# EAGLE design breakout-r2 (EAGLE 8.3.1)
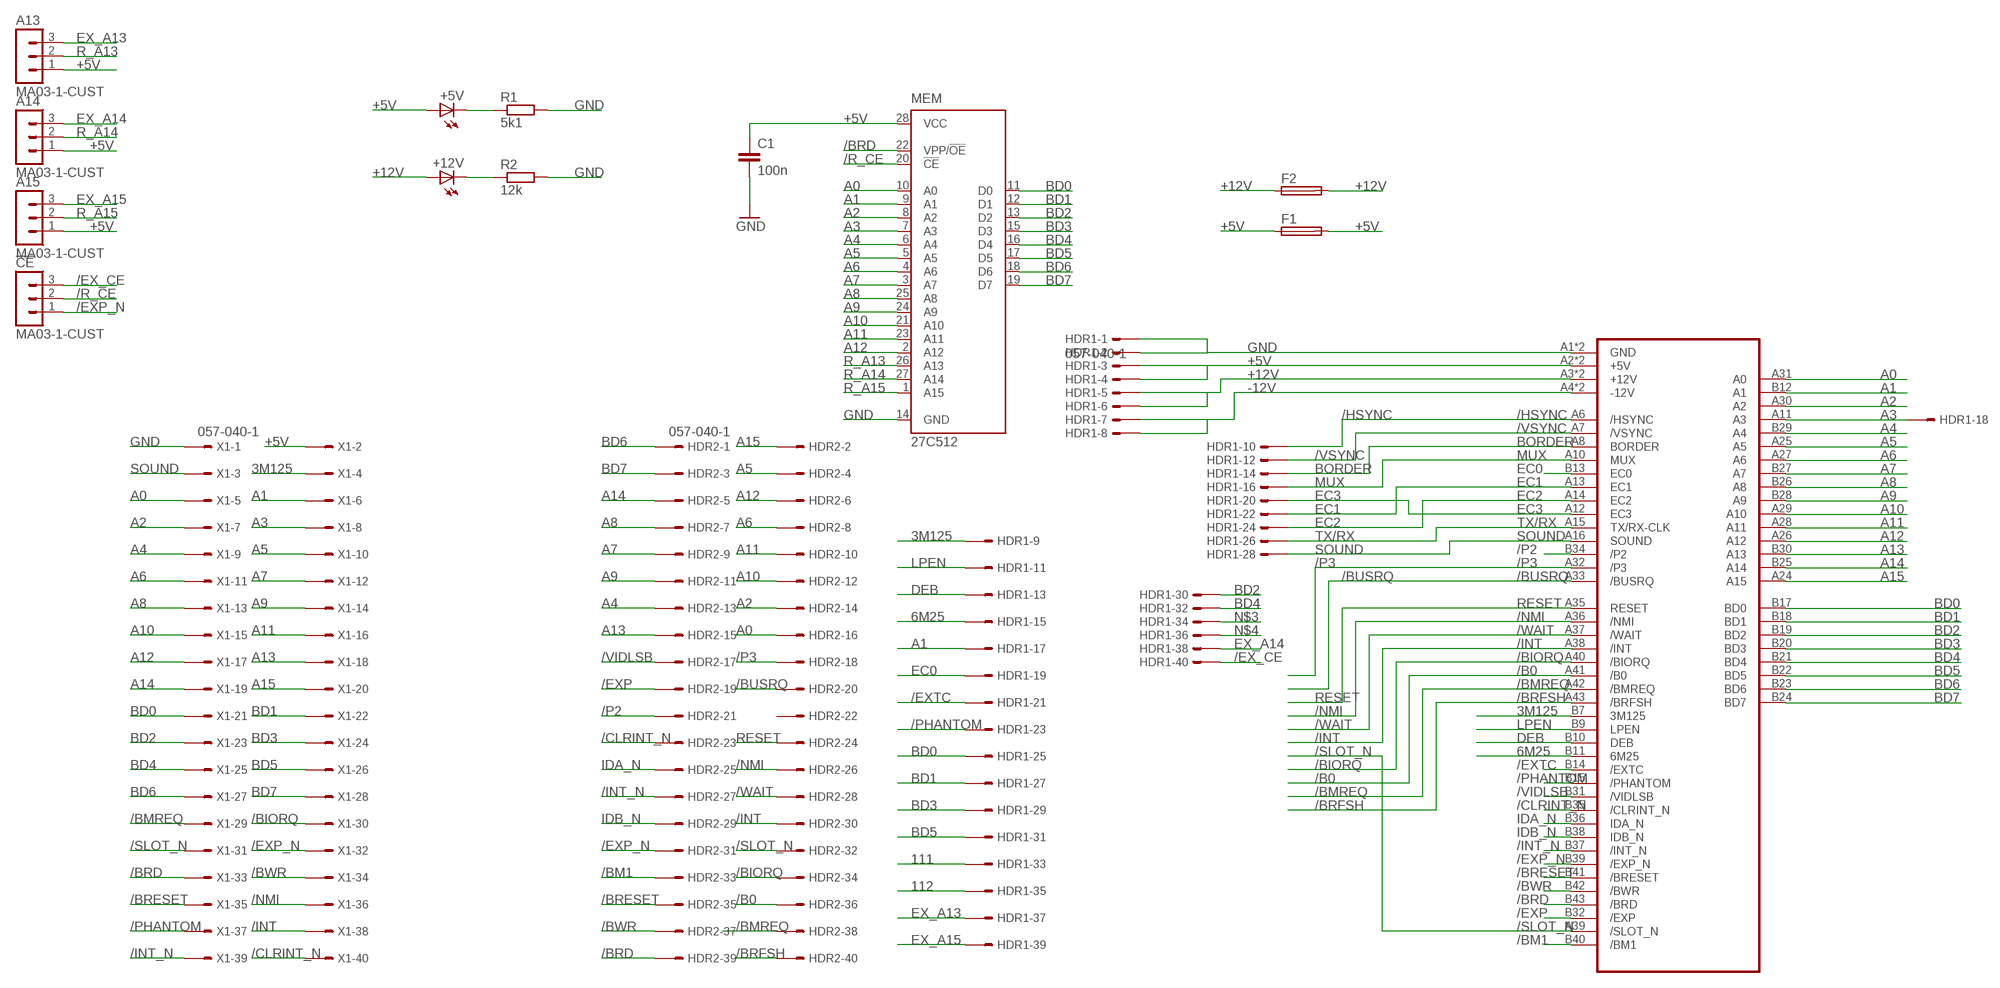
[diagram p0: schematic, sheet 1]

## Parts
!CE  MA03-1-CUST  [MA03-1]
+5V  LED3MM  [LED3MM]
+12V  LED3MM  [LED3MM]
A13  MA03-1-CUST  [MA03-1]
A14  MA03-1-CUST  [MA03-1]
A15  MA03-1-CUST  [MA03-1]
C1  100n  C-EU025-025X050  [C025-025X050]
F1  TE5  [TE5]
F2  TE5  [TE5]
HDR1  057-040-1  [057-040-1]
HDR2  057-040-1  [057-040-1]
MEM  27C512  W27C512  [DIL28-6]
R1  5k1  R-EU_0204/7  [0204/7]
R2  12k  R-EU_0204/7  [0204/7]
U$1  TVC-EXP-HBA-COMMON  [TVC-EXP-EDGE]
X1  057-040-1  [057-040-1]

## Nets
3M125: HDR1.9 U$1.B7(3M125) X1.4
6M25: HDR1.15 U$1.B11(6M25)
111: HDR1.33
112: HDR1.35
+5V [pwr]: +5V.A A13.1 A14.1 A15.1 C1.1 F1.1 F1.2 HDR1.3 HDR1.4 MEM.28(VCC) U$1.A2(+5V) U$1.B2(+5V) X1.2
+12V [pwr]: +12V.A F2.1 F2.2 HDR1.5 HDR1.6 U$1.A3(+12V) U$1.B3(+12V)
-12V [pwr]: HDR1.7 HDR1.8 U$1.A4(-12V) U$1.B4(-12V)
/B0: HDR2.36 U$1.A41(/B0)
/BIORQ: HDR2.34 U$1.A40(/BIORQ) X1.30
/BM1: HDR2.33 U$1.B40(/BM1)
/BMREQ: HDR2.38 U$1.A42(/BMREQ) X1.29
/BRD: HDR2.39 MEM.22(VPP/!OE) U$1.B43(/BRD) X1.33
/BRESET: HDR2.35 U$1.B41(/BRESET) X1.35
/BRFSH: HDR2.40 U$1.A43(/BRFSH)
/BUSRQ: HDR2.20 U$1.A33(/BUSRQ)
/BWR: HDR2.37 U$1.B42(/BWR) X1.34
/CLRINT_N: HDR2.23 U$1.B35(/CLRINT_N) X1.40
/EX_CE: !CE.3 HDR1.40
/EXP: HDR2.19 U$1.B32(/EXP)
/EXP_N: !CE.1 HDR2.31 U$1.B39(/EXP_N) X1.32
/EXTC: HDR1.21 U$1.B14(/EXTC)
/HSYNC: HDR1.10 U$1.A6(/HSYNC)
/INT: HDR2.30 U$1.A38(/INT) X1.38
/INT_N: HDR2.27 U$1.B37(/INT_N) X1.39
/NMI: HDR2.26 U$1.A36(/NMI) X1.36
/P2: HDR2.21 U$1.B34(/P2)
/P3: HDR2.18 U$1.A32(/P3)
/PHANTOM: HDR1.23 U$1.B15(/PHANTOM) X1.37
/R_CE: !CE.2 MEM.20(!CE)
/SLOT_N: HDR2.32 U$1.A39(/SLOT_N) X1.31
/VIDLSB: HDR2.17 U$1.B31(/VIDLSB)
/VSYNC: HDR1.12 U$1.A7(/VSYNC)
/WAIT: HDR2.28 U$1.A37(/WAIT)
A0: HDR2.16 MEM.10(A0) U$1.A31(A0) X1.5
A1: HDR1.17 MEM.9(A1) U$1.B12(A1) X1.6
A2: HDR2.14 MEM.8(A2) U$1.A30(A2) X1.7
A3: HDR1.18 MEM.7(A3) U$1.A11(A3) X1.8
A4: HDR2.13 MEM.6(A4) U$1.B29(A4) X1.9
A5: HDR2.4 MEM.5(A5) U$1.A25(A5) X1.10
A6: HDR2.8 MEM.4(A6) U$1.A27(A6) X1.11
A7: HDR2.9 MEM.3(A7) U$1.B27(A7) X1.12
A8: HDR2.7 MEM.25(A8) U$1.B26(A8) X1.13
A9: HDR2.11 MEM.24(A9) U$1.B28(A9) X1.14
A10: HDR2.12 MEM.21(A10) U$1.A29(A10) X1.15
A11: HDR2.10 MEM.23(A11) U$1.A28(A11) X1.16
A12: HDR2.6 MEM.2(A12) U$1.A26(A12) X1.17
A13: HDR2.15 U$1.B30(A13) X1.18
A14: HDR2.5 U$1.B25(A14) X1.19
A15: HDR2.2 U$1.A24(A15) X1.20
BD0: HDR1.25 MEM.11(D0) U$1.B17(BD0) X1.21
BD1: HDR1.27 MEM.12(D1) U$1.B18(BD1) X1.22
BD2: HDR1.30 MEM.13(D2) U$1.B19(BD2) X1.23
BD3: HDR1.29 MEM.15(D3) U$1.B20(BD3) X1.24
BD4: HDR1.32 MEM.16(D4) U$1.B21(BD4) X1.25
BD5: HDR1.31 MEM.17(D5) U$1.B22(BD5) X1.26
BD6: HDR2.1 MEM.18(D6) U$1.B23(BD6) X1.27
BD7: HDR2.3 MEM.19(D7) U$1.B24(BD7) X1.28
BORDER: HDR1.14 U$1.A8(BORDER)
DEB: HDR1.13 U$1.B10(DEB)
EC0: HDR1.19 U$1.B13(EC0)
EC1: HDR1.22 U$1.A13(EC1)
EC2: HDR1.24 U$1.A14(EC2)
EC3: HDR1.20 U$1.A12(EC3)
EX_A13: A13.3 HDR1.37
EX_A14: A14.3 HDR1.38
EX_A15: A15.3 HDR1.39
GND [pwr]: C1.2 HDR1.1 HDR1.2 MEM.14(GND) R1.2 R2.2 U$1.A1(GND) U$1.B1(GND) X1.1
IDA_N: HDR2.25 U$1.B36(IDA_N)
IDB_N: HDR2.29 U$1.B38(IDB_N)
LPEN: HDR1.11 U$1.B9(LPEN)
MUX: HDR1.16 U$1.A10(MUX)
N$1: +5V.K(C) R1.1
N$2: +12V.K(C) R2.1
N$3: HDR1.34
N$4: HDR1.36
R_A13: A13.2 MEM.26(A13)
R_A14: A14.2 MEM.27(A14)
R_A15: A15.2 MEM.1(A15)
RESET: HDR2.24 U$1.A35(RESET)
SOUND: HDR1.28 U$1.A16(SOUND) X1.3
TX/RX: HDR1.26 U$1.A15(TX/RX-CLK)
Unconnected: HDR2.22

## Library data of the parts
!CE A13-A15 = MA03-1-custom:MA03-1-CUST
+5V +12V = led:LED: LED OSRAM: - CHIPLED LG R971, LG N971, LY N971, LG Q971, LY Q971, LO R971, LY R971 LH N974, LH R974 LS Q976, LO Q976, LY Q976 LO Q996 - Hyper CHIPLED LW Q18S LB Q993, LB Q99A, LB R99A - SideLED LS A670, LO A670, LY A670, LG A670, LP A670 LB A673, LV A673, LT A673, LW A673 LH A674 LY A675 LS A676, LA A676, LO A676, LY A676, LW A676 LS A679, LY A679, LG A679 - Hyper Micro SIDELED® LS Y876, LA Y876, LO Y876, LY Y876 LT Y87S - SmartLED LW L88C, LW L88S LB L89C, LB L89S, LG L890 LS L89K, LO L89K, LY L89K LS L896, LA L896, LO L896, LY L896 - TOPLED LS T670, LO T670, LY T670, LG T670, LP T670 LSG T670, LSP T670, LSY T670, LOP T670, LYG T670 LG T671, LOG T671, LSG T671 LB T673, LV T673, LT T673, LW T673 LH T674 LS T676, LA T676, LO T676, LY T676, LB T676, LH T676, LSB T676, LW T676 LB T67C, LV T67C, LT T67C, LS T67K, LO T67K, LY T67K, LW E67C LS E67B, LA E67B, LO E67B, LY E67B, LB E67C, LV E67C, LT E67C LW T67C LS T679, LY T679, LG T679 LS T770, LO T770, LY T770, LG T770, LP T770 LB T773, LV T773, LT T773, LW T773 LH T774 LS E675, LA E675, LY E675, LS T675 LS T776, LA T776, LO T776, LY T776, LB T776 LHGB T686 LT T68C, LB T68C - Hyper Mini TOPLED® LB M676 - Mini TOPLED Santana® LG M470 LS M47K, LO M47K, LY M47K Source: http://www.osram.convergy.de LUXEON: - LUMILED® LXK2-PW12-R00, LXK2-PW12-S00, LXK2-PW14-U00, LXK2-PW14-V00 LXK2-PM12-R00, LXK2-PM12-S00, LXK2-PM14-U00 LXK2-PE12-Q00, LXK2-PE12-R00, LXK2-PE12-S00, LXK2-PE14-T00, LXK2-PE14-U00 LXK2-PB12-K00, LXK2-PB12-L00, LXK2-PB12-M00, LXK2-PB14-N00, LXK2-PB14-P00, LXK2-PB14-Q00 LXK2-PR12-L00, LXK2-PR12-M00, LXK2-PR14-Q00, LXK2-PR14-R00 LXK2-PD12-Q00, LXK2-PD12-R00, LXK2-PD12-S00 LXK2-PH12-R00, LXK2-PH12-S00 LXK2-PL12-P00, LXK2-PL12-Q00, LXK2-PL12-R00 Source: www.luxeon.com KINGBRIGHT: KA-3528ASYC Source: www.kingbright.com
C1 = rcl:C-EU: CAPACITOR, European symbol
F1 F2 = fuse:TE5: FUSE Wickmann; OC_FARNELL: unknown; OC_NEWARK: unknown
HDR1 HDR2 X1 = con-panduit:057-040-: CONNECTOR 40-pin series 057 contact pc board low profile headers; OC_FARNELL: unknown; OC_NEWARK: unknown
MEM = Winbond:W27C512
R1 R2 = resistor:R-EU_: RESISTOR, European symbol
U$1 = tvc-exp:TVC-EXP-HBA-COMMON: Videoton TV-Computer expansion port edge connector, common pins for 32k, 64k and 64k+

## Net classes
0 default: width 0.254 mm
1 pwr: width 0.508 mm, clearance 0.254 mm

## Board
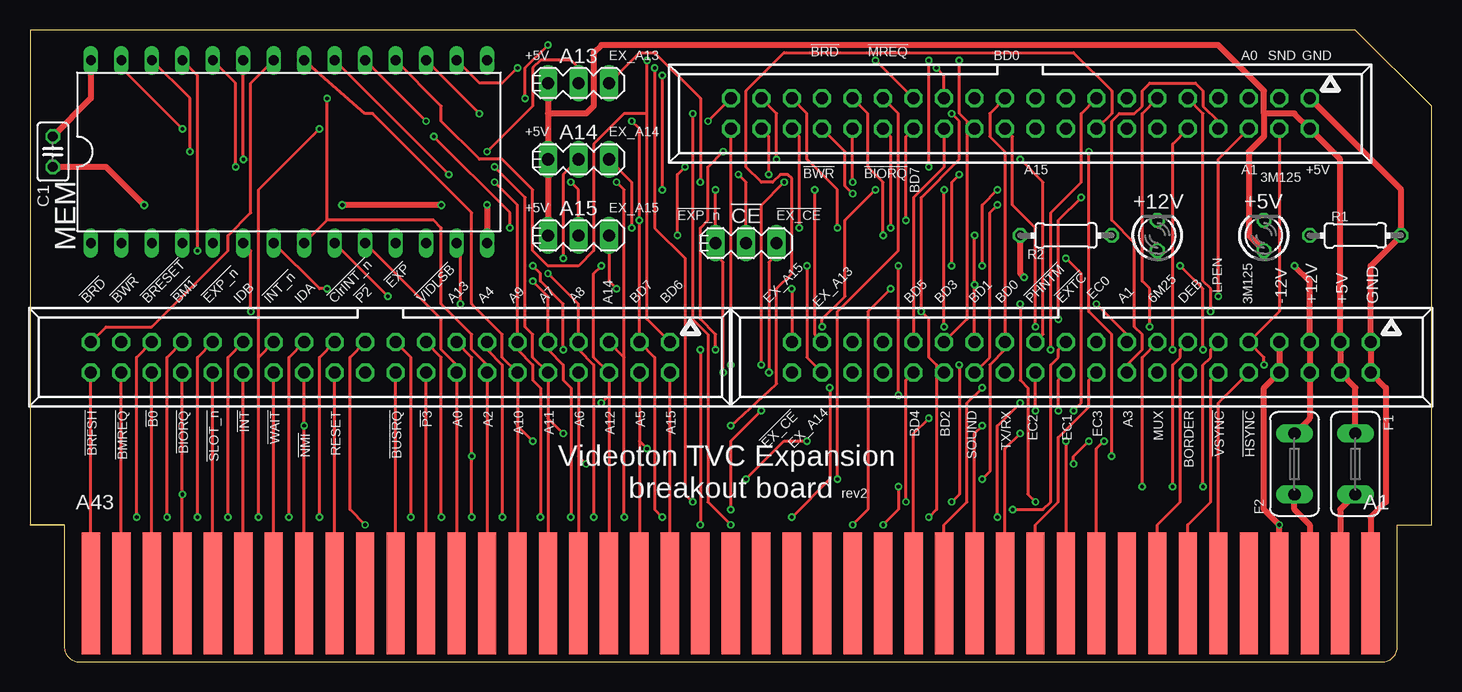
[diagram p1: board, top side]
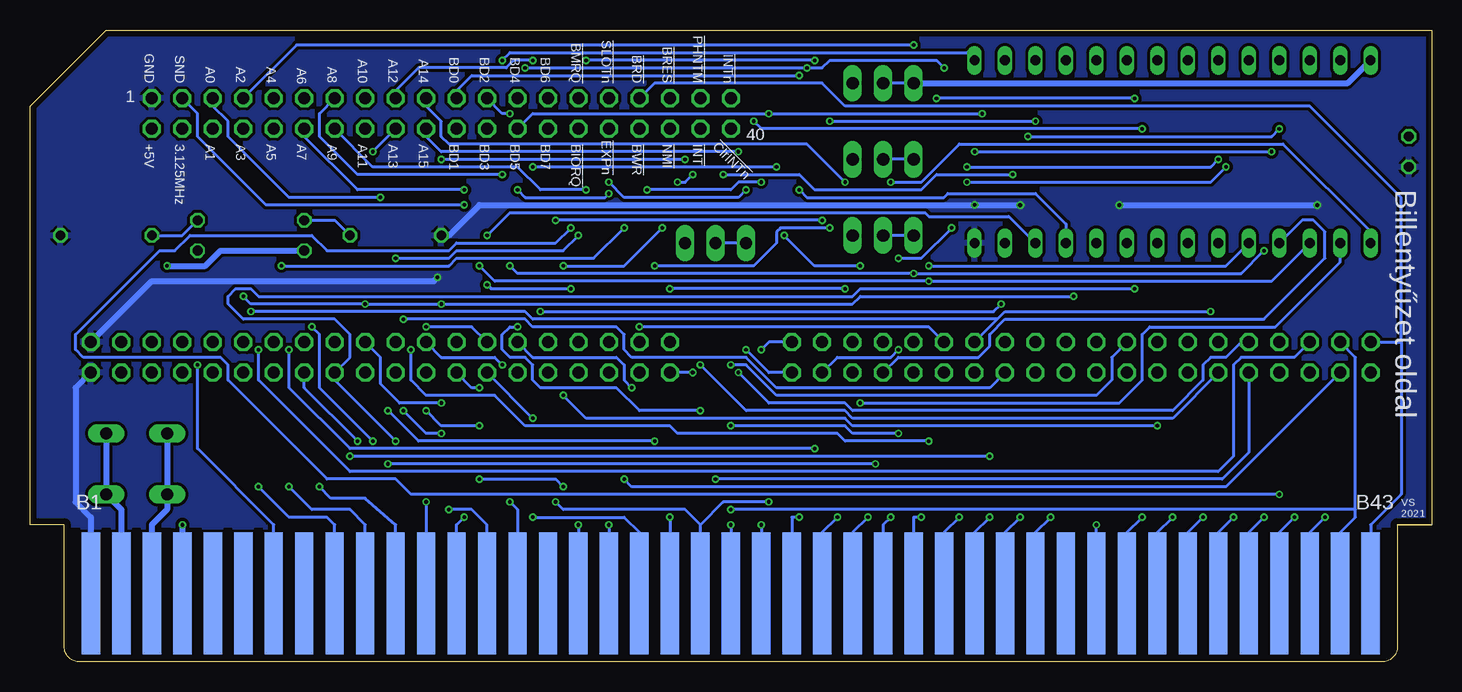
[diagram p2: board, bottom side, seen from below]

Size 116.84 x 52.7 mm. Coordinates in mm from the lower left corner, seen from the top.
Outline: 113.98,11.43 116.84,11.43 116.84,46.35 110.49,52.7 0,52.7 0,11.43 2.86,11.43
Copper layers (1*16): Top 0.035mm / dielectric 1.6mm / Bottom 0.035mm
Design rules "Elecrow_2-layer_PCB_eagle_rule": minimum track width 6mil, minimum drill 12mil, track to track 6mil, track to pad 6mil, pad to pad 6mil, via to via 8mil, smd to smd 0mil, copper to edge 20mil, drill to drill 10mil, minimum pad ring 6mil, minimum via ring 6mil, stop-mask expansion 0mil, vias tented up to drill 100mil, thermal gap 10mil
bRestrict: area 44.1,47 to 44.8,49.5; area 44.1,40.6 to 44.8,43.2; area 44.1,34.3 to 44.8,36.8; area 58.1,33.7 to 58.7,36.2

### Footprints (pad centres in the part's own frame; a part is rotated, then mirrored left to right if it is on the bottom)
MA03-1 = drill 1.016 long: 1 -2.54,0; 2 0,0; 3 2.54,0
LED3MM = drill 0.813 octagon: A -1.27,0; K 1.27,0
C025-025X050 = drill 0.813 octagon: 1 -1.27,0; 2 1.27,0
TE5 = drill 1.016 long: 1 -2.54,0; 2 2.54,0
057-040-1 = drill 1 octagon: 1 -24.13,-1.27; 2 -24.13,1.27; 3 -21.59,-1.27; 4 -21.59,1.27; 5 -19.05,-1.27; 6 -19.05,1.27; 7 -16.51,-1.27; 8 -16.51,1.27; 9 -13.97,-1.27; 10 -13.97,1.27; 11 -11.43,-1.27; 12 -11.43,1.27; 13 -8.89,-1.27; 14 -8.89,1.27; 15 -6.35,-1.27; 16 -6.35,1.27; 17 -3.81,-1.27; 18 -3.81,1.27; 19 -1.27,-1.27; 20 -1.27,1.27; 21 1.27,-1.27; 22 1.27,1.27; 23 3.81,-1.27; 24 3.81,1.27; 25 6.35,-1.27; 26 6.35,1.27; 27 8.89,-1.27; 28 8.89,1.27; 29 11.43,-1.27; 30 11.43,1.27; 31 13.97,-1.27; 32 13.97,1.27; 33 16.51,-1.27; 34 16.51,1.27; 35 19.05,-1.27; 36 19.05,1.27; 37 21.59,-1.27; 38 21.59,1.27; 39 24.13,-1.27; 40 24.13,1.27
DIL28-6 = drill 0.813 long: 1 -16.51,-7.62; 2 -13.97,-7.62; 3 -11.43,-7.62; 4 -8.89,-7.62; 5 -6.35,-7.62; 6 -3.81,-7.62; 7 -1.27,-7.62; 8 1.27,-7.62; 9 3.81,-7.62; 10 6.35,-7.62; 11 8.89,-7.62; 12 11.43,-7.62; 13 13.97,-7.62; 14 16.51,-7.62; 15 16.51,7.62; 16 13.97,7.62; 17 11.43,7.62; 18 8.89,7.62; 19 6.35,7.62; 20 3.81,7.62; 21 1.27,7.62; 22 -1.27,7.62; 23 -3.81,7.62; 24 -6.35,7.62; 25 -8.89,7.62; 26 -11.43,7.62; 27 -13.97,7.62; 28 -16.51,7.62
0204/7 = drill 0.813 octagon: 1 -3.81,0; 2 3.81,0
TVC-EXP-EDGE = smd 1.524 x 10.16: A1 53.34,-5.715; A2 50.8,-5.715; A3 48.26,-5.715; A4 45.72,-5.715; A5 43.18,-5.715; A6 40.64,-5.715; A7 38.1,-5.715; A8 35.56,-5.715; A9 33.02,-5.715; A10 30.48,-5.715; A11 27.94,-5.715; A12 25.4,-5.715; A13 22.86,-5.715; A14 20.32,-5.715; A15 17.78,-5.715; A16 15.24,-5.715; A17 12.7,-5.715; A18 10.16,-5.715; A19 7.62,-5.715; A20 5.08,-5.715; A21 2.54,-5.715; A22 0,-5.715; A23 -2.54,-5.715; A24 -5.08,-5.715; A25 -7.62,-5.715; A26 -10.16,-5.715; A27 -12.7,-5.715; A28 -15.24,-5.715; A29 -17.78,-5.715; A30 -20.32,-5.715; A31 -22.86,-5.715; A32 -25.4,-5.715; A33 -27.94,-5.715; A34 -30.48,-5.715; A35 -33.02,-5.715; A36 -35.56,-5.715; A37 -38.1,-5.715; A38 -40.64,-5.715; A39 -43.18,-5.715; A40 -45.72,-5.715; A41 -48.26,-5.715; A42 -50.8,-5.715; A43 -53.34,-5.715 | smd 1.524 x 10.16 bottom: B1 53.34,-5.715; B2 50.8,-5.715; B3 48.26,-5.715; B4 45.72,-5.715; B5 43.18,-5.715; B6 40.64,-5.715; B7 38.1,-5.715; B8 35.56,-5.715; B9 33.02,-5.715; B10 30.48,-5.715; B11 27.94,-5.715; B12 25.4,-5.715; B13 22.86,-5.715; B14 20.32,-5.715; B15 17.78,-5.715; B16 15.24,-5.715; B17 12.7,-5.715; B18 10.16,-5.715; B19 7.62,-5.715; B20 5.08,-5.715; B21 2.54,-5.715; B22 0,-5.715; B23 -2.54,-5.715; B24 -5.08,-5.715; B25 -7.62,-5.715; B26 -10.16,-5.715; B27 -12.7,-5.715; B28 -15.24,-5.715; B29 -17.78,-5.715; B30 -20.32,-5.715; B31 -22.86,-5.715; B32 -25.4,-5.715; B33 -27.94,-5.715; B34 -30.48,-5.715; B35 -33.02,-5.715; B36 -35.56,-5.715; B37 -38.1,-5.715; B38 -40.64,-5.715; B39 -43.18,-5.715; B40 -45.72,-5.715; B41 -48.26,-5.715; B42 -50.8,-5.715; B43 -53.34,-5.715

### Placement (x,y rotation side)
!CE  59.69,34.92 0 top
+5V  102.87,35.56 90 top
+12V  93.98,35.56 90 top
A13  45.72,48.26 0 top
A14  45.72,41.91 0 top
A15  45.72,35.56 0 top
C1  1.9,42.55 270 top
F1  110.49,16.51 90 top
F2  105.41,16.51 90 top
HDR1  87.63,25.4 180 top
HDR2  29.21,25.4 180 top
MEM  21.59,42.55 0 top
R1  110.49,35.56 0 top
R2  86.36,35.56 180 top
U$1  58.42,11.43 0 top
X1  82.55,45.72 180 top

### Tracks (layer width: path | path; a pad name or v marks a point on that pad's centre or on a via)
3M125  (via drill 0.3)
  Top 0.254: X1.4 104.14,29.21 HDR1.9 102.87,25.4 v102.87,24.77
  Bottom 0.254: v102.87,24.77 102.87,17.78 96.52,11.43 U$1.B7
6M25  (via drill 0.3)
  Top 0.254: HDR1.15 92.71,25.4 v92.71,14.61
  Bottom 0.254: v92.71,14.61 91.76,13.65 88.9,13.65 86.36,11.43 U$1.B11
+5V
  Top 0.508: A15.1 A14.1 43.18,45.72 | A13.1 43.18,45.72 | +5V.A 101.6,35.56 101.6,42.55 102.87,43.81 102.87,45.72 | 102.87,45.72 105.41,45.72 X1.2 109.22,41.91 HDR1.3 HDR1.4 110.49,22.86 F1.2 | U$1.B2 109.22,12.7 F1.1 | 43.18,45.72 46.35,45.72 46.99,46.35 46.99,50.8 47.62,51.44 99.06,51.44 102.87,47.62 102.87,45.72 | MEM.28 5.08,46.99 C1.1
  Bottom 0.508: MEM.28 6.99,48.26 A13.1 | F1.2 F1.1 109.22,12.7 U$1.B2
+12V  (via drill 0.3)
  Top 0.508: v105.41,33.02 106.68,31.75 HDR1.5 HDR1.6 106.68,20.32 F2.2 | U$1.B3 106.68,11.43 105.41,12.7 F2.1
  Bottom 0.508: F2.2 F2.1 105.41,12.7 106.68,11.43 U$1.B3 | +12V.A 100.97,34.29 102.23,33.02 v105.41,33.02
-12V  (via drill 0.3)
  Top 0.508: HDR1.7 HDR1.8 102.87,22.86 102.87,12.7 v104.14,11.43 U$1.B4
  Bottom 0.508: v104.14,11.43 U$1.B4
/B0
  Top 0.254: U$1.A41 HDR2.36
/BIORQ  (via drill 0.3)
  Top 0.254: U$1.A40 v12.7,13.97 HDR2.34 | X1.30 71.76,43.81 v71.76,36.2
  Bottom 0.254: v71.76,36.2 73.03,34.92 81.28,34.92 81.92,34.29 92.08,34.29 93.34,35.56 103.51,35.56 104.78,34.29 106.05,34.29 113.03,27.3 113.03,26.04 112.4,25.4 100.97,25.4 100.33,24.77 100.33,23.5 92.08,15.24 86.36,15.24 85.09,13.97 v12.7,13.97
/BM1  (via drill 0.3)
  Top 0.254: HDR2.33 11.43,25.4 v11.43,12.06
  Bottom 0.254: U$1.B40 12.7,10.79 v11.43,12.06
/BMREQ  (via drill 0.3)
  Top 0.254: U$1.A42 HDR2.38 | X1.29 72.39,45.72 72.39,34.29 67.31,29.21 v67.31,15.24
  Bottom 0.254: v67.31,15.24 66.67,14.61 17.14,14.61 HDR2.38
/BRD
  Top 0.254: MEM.22 18.41,48.26 18.41,37.47 16.51,35.56 16.51,34.29 10.16,27.94 6.35,27.94 HDR2.39
  Bottom 0.254: X1.33 64.77,48.26 50.8,48.26 48.89,46.35 10.16,46.35 2.54,38.73 2.54,26.67 | HDR2.39 2.54,26.67 | U$1.B43 5.08,11.43 2.54,13.97 2.54,26.67
/BRESET  (via drill 0.3)
  Top 0.254: HDR2.35 8.89,25.4 v8.89,12.06 | X1.35 64.77,45.72 64.77,41.91 67.31,39.37 v67.31,36.2 | v95.89,33.02 97.79,31.11 v97.79,26.04
  Bottom 0.254: U$1.B41 10.16,10.79 v8.89,12.06 | v67.31,36.2 69.85,33.66 81.28,33.66 81.92,33.02 v95.89,33.02 | v97.79,26.04 97.79,23.5 90.17,15.88 17.78,15.88 16.51,17.14 16.51,24.77 15.88,25.4 11.43,25.4 HDR2.35
/BRFSH
  Top 0.254: U$1.A43 HDR2.40
/BUSRQ
  Top 0.254: U$1.A33 HDR2.20
/BWR  (via drill 0.3)
  Top 0.254: X1.34 67.95,42.55 67.95,39.69 v68.58,39.05 | v76.2,27.94 v76.2,39.37 | v60.96,20.95 58.42,18.41 v58.42,12.7
  Bottom 0.254: HDR2.37 6.35,25.4 6.35,12.7 | 6.35,12.7 6.35,12.06 7.62,10.79 U$1.B42 | v68.58,39.05 68.9,38.73 75.56,38.73 v76.2,39.37 | v76.2,27.94 76.84,27.94 77.47,27.3 77.47,26.04 76.84,25.4 75.56,25.4 74.93,24.77 74.93,23.5 74.3,22.86 67.95,22.86 66.04,20.95 v60.96,20.95 | 6.35,12.7 v58.42,12.7
/CLRINT_N  (via drill 0.3)
  Top 0.254: HDR2.23 24.13,25.4 v24.13,12.06 | v58.42,24.77 X1.40
  Bottom 0.254: U$1.B35 25.4,10.79 v24.13,12.06 | v58.42,24.77 57.15,24.77 54.61,22.23 27.94,22.23 26.67,23.5 26.67,25.4 HDR2.23
/EX_CE  (via drill 0.35)
  Top 0.254: v61.59,24.13 61.59,33.34 62.23,33.97 !CE.3
  Bottom 0.254: v61.59,24.13 HDR1.40
/EXP  (via drill 0.3)
  Top 0.254: HDR2.19 31.75,25.4 v31.75,12.06
  Bottom 0.254: U$1.B32 33.02,10.79 v31.75,12.06
/EXP_N  (via drill 0.3)
  Top 0.254: v68.58,40.01 X1.32 | v57.15,39.37 !CE.1 57.15,33.97 57.78,33.34 v57.78,24.13 | HDR2.31 13.97,25.4 v13.97,12.06
  Bottom 0.254: v68.58,40.01 67.31,38.73 57.78,38.73 v57.15,39.37 | U$1.B39 15.24,10.79 v13.97,12.06 | v57.78,24.13 55.24,21.59 48.89,21.59 48.26,20.95 21.59,20.95 19.05,23.5 19.05,24.77 18.41,25.4 17.14,25.4 15.88,26.67 HDR2.31
/EXTC  (via drill 0.3)
  Top 0.254: HDR1.21 85.73,26.04 85.73,25.4 85.09,24.77 85.09,13.34 84.45,12.7 v81.92,12.7
  Bottom 0.254: U$1.B14 78.74,11.43 80.01,12.7 v81.92,12.7
/HSYNC
  Top 0.254: HDR1.10 99.06,21.59 U$1.A6
/INT  (via drill 0.3)
  Top 0.254: U$1.A38 HDR2.30 | X1.38 61.59,43.81 v61.59,40.64 | v62.87,40.01 60.96,38.1 v60.96,24.77
  Bottom 0.254: v61.59,40.64 62.23,40.01 v62.87,40.01 | v60.96,24.77 57.15,20.95 48.89,20.95 48.26,20.32 21.59,20.32 HDR2.30
/INT_N  (via drill 0.3)
  Top 0.254: 19.05,25.4 HDR2.27 | v19.05,12.06 19.05,25.4 | v56.51,45.09 X1.39 | v24.13,44.45 19.05,39.37 19.05,25.4
  Bottom 0.254: U$1.B37 20.32,10.79 v19.05,12.06 | v56.51,45.09 55.88,44.45 v24.13,44.45
/NMI  (via drill 0.3)
  Top 0.254: U$1.A36 v22.86,19.68 HDR2.26 | X1.36 64.14,43.81 v64.14,36.2 | v72.39,22.23 v72.39,33.02
  Bottom 0.254: v64.14,36.2 67.31,33.02 v72.39,33.02 | v72.39,22.23 70.48,20.32 48.89,20.32 48.26,19.68 v22.86,19.68
/P2  (via drill 0.3)
  Top 0.254: HDR2.21 26.67,25.4 26.67,12.7 v27.94,11.43
  Bottom 0.254: U$1.B34 v27.94,11.43
/P3
  Top 0.254: U$1.A32 HDR2.18
/PHANTOM  (via drill 0.3)
  Top 0.254: X1.37 62.23,45.72 v62.23,41.91 | v82.55,41.91 84.45,40.01 84.45,27.3 HDR1.23 | v76.84,13.34 77.47,13.97 v77.47,24.77
  Bottom 0.254: v82.55,41.91 v62.23,41.91 | v76.84,13.34 76.2,12.7 U$1.B15 | v77.47,24.77 78.11,25.4 82.55,25.4 HDR1.23
/R_CE  (via drill 0.3)
  Top 0.254: v34.92,40.64 MEM.20 | v59.05,40.64 59.69,40.01 !CE.2
  Bottom 0.254: v34.92,40.64 41.27,40.64 42.54,39.37 51.43,39.37 52.7,40.64 v59.05,40.64
/SLOT_N  (via drill 0.3)
  Top 0.254: U$1.A39 HDR2.32 | X1.31 69.85,45.72 69.85,41.27 71.12,40.01 v71.12,35.56 | v86.36,33.66 87.63,32.38 87.63,21.59 v87,20.95 | v59.69,15.24 62.87,18.41 v64.77,18.41
  Bottom 0.254: v71.12,35.56 72.39,34.29 81.28,34.29 81.92,33.66 v86.36,33.66 | v87,20.95 84.45,18.41 v64.77,18.41 | HDR2.32 15.24,17.46 17.46,15.24 v59.69,15.24
/VIDLSB  (via drill 0.3)
  Top 0.254: HDR2.17 34.29,25.4 v34.29,12.06
  Bottom 0.254: U$1.B31 35.56,10.79 v34.29,12.06
/VSYNC
  Top 0.254: HDR1.12 98.42,23.5 98.42,13.34 96.52,11.43 U$1.A7
/WAIT
  Top 0.254: U$1.A37 HDR2.28
A0  (via drill 0.3)
  Top 0.254: MEM.10 34.29,28.57 34.29,26.04 35.56,24.77 HDR2.16 U$1.A31 | v87.63,38.73 85.73,36.83 v85.73,28.57
  Bottom 0.254: X1.5 101.6,46.35 100.33,45.09 100.33,43.81 95.25,38.73 v87.63,38.73 | v85.73,28.57 75.56,28.57 74.93,27.94 67.95,27.94 67.31,27.3 67.31,26.04 66.67,25.4 57.15,25.4 54.61,22.86 36.83,22.86 HDR2.16
A1  (via drill 0.3)
  Top 0.254: v29.84,30.48 MEM.9 | v88.9,29.84 91.44,27.3 HDR1.17 | X1.6 99.06,41.91 v99.06,30.48 | v83.82,13.34 83.19,13.97 83.19,22.86 82.55,23.5 v82.55,29.84
  Bottom 0.254: v29.84,30.48 47.62,30.48 48.26,29.84 v82.55,29.84 v88.9,29.84 98.42,29.84 v99.06,30.48 | v83.82,13.34 U$1.B12
A2  (via drill 0.3)
  Top 0.254: 24.77,36.83 MEM.8 | 24.77,36.83 33.65,36.83 34.29,36.2 34.29,29.84 36.83,27.3 36.83,26.04 38.1,24.77 HDR2.14 U$1.A30 | v43.18,51.44 41.27,49.53 v41.27,46.99 | 24.77,36.83 v24.77,46.99
  Bottom 0.254: X1.7 94.62,51.44 v43.18,51.44 | v24.77,46.99 v41.27,46.99
A3  (via drill 0.3)
  Top 0.254: v24.77,31.11 24.13,31.11 MEM.7 | X1.8 99.06,45.09 97.79,46.35 97.79,47.62 97.16,48.26 93.34,48.26 92.71,47.62 92.71,46.35 92.08,45.72 90.81,45.72 90.17,45.09 90.17,36.83 92.08,34.92 92.08,27.94 92.71,27.3 92.71,26.04 91.44,24.77 HDR1.18 | v86.36,18.41 U$1.A11
  Bottom 0.254: v24.77,31.11 47.62,31.11 48.26,30.48 97.79,30.48 98.42,31.11 99.7,31.11 100.33,30.48 100.33,29.84 99.06,28.57 91.44,28.57 90.17,27.3 90.17,25.4 HDR1.18 91.44,23.5 v86.36,18.41
A4  (via drill 0.3)
  Top 0.254: MEM.6 18.41,34.29 v18.41,29.21 | X1.9 97.79,45.72 97.79,31.75 98.42,31.11 v98.42,29.21 | v39.37,12.06 39.37,24.77 38.1,26.04 HDR2.13
  Bottom 0.254: v18.41,29.21 35.56,29.21 36.2,28.57 | HDR2.13 36.2,28.57 | v98.42,29.21 75.56,29.21 74.93,28.57 36.2,28.57 | v39.37,12.06 40.64,10.79 U$1.B29
A5  (via drill 0.3)
  Top 0.254: v41.91,33.02 42.54,32.38 42.54,31.75 44.45,29.84 v44.45,26.04 | X1.10 95.25,43.18 v95.25,26.04 | 50.8,18.41 v51.43,17.78 | HDR2.4 50.8,18.41 | 50.8,18.41 U$1.A25
  Bottom 0.254: MEM.5 17.14,33.02 v41.91,33.02 | v44.45,26.04 45.08,25.4 49.53,25.4 HDR2.4 | v51.43,17.78 90.17,17.78 95.25,22.86 v95.25,26.04
A6  (via drill 0.3)
  Top 0.254: X1.11 92.71,45.72 92.71,31.75 93.34,31.11 v93.34,27.94 | v88.27,18.41 87,17.14 v87,16.51 | 45.72,17.14 v46.35,16.51 | HDR2.8 45.72,17.14 | 45.72,17.14 U$1.A27
  Bottom 0.254: MEM.4 10.79,36.83 9.84,36.83 8.89,35.88 8.89,33.66 13.97,28.57 35.56,28.57 36.83,27.3 36.83,26.35 37.78,25.4 44.45,25.4 HDR2.8 | v93.34,27.94 92.71,27.3 92.71,22.86 v88.27,18.41 | v46.35,16.51 v87,16.51
A7  (via drill 0.3)
  Top 0.254: v41.91,31.75 43.18,30.48 HDR2.9 43.18,26.04 44.45,24.77 44.45,23.5 45.08,22.86 v45.08,12.06 | v80.65,39.37 79.38,38.1 v79.38,33.02
  Bottom 0.254: MEM.3 13.34,31.75 v41.91,31.75 78.11,31.75 v79.38,33.02 | v80.65,39.37 89.54,39.37 93.98,43.81 X1.12 | v45.08,12.06 45.72,11.43 U$1.B27
A8  (via drill 0.3)
  Top 0.254: MEM.25 13.97,48.9 v13.97,34.29 | v43.18,32.38 45.72,29.84 HDR2.7 45.72,26.04 46.99,24.77 v46.99,12.06 | v77.47,40.64 76.84,40.01 v76.84,33.02
  Bottom 0.254: v13.97,34.29 15.88,32.38 v43.18,32.38 76.2,32.38 v76.84,33.02 | X1.13 92.71,45.72 92.71,43.81 89.54,40.64 v77.47,40.64 | v46.99,12.06 48.26,10.79 U$1.B26
A9  (via drill 0.3)
  Top 0.254: MEM.24 17.14,48.26 v17.14,41.27 | v38.73,40.01 40.64,38.1 HDR2.11 40.64,26.04 41.91,24.77 41.91,23.5 42.54,22.86 v42.54,12.06 | v70.48,39.37 67.95,36.83 67.95,30.48 66.04,28.57 v66.04,27.94
  Bottom 0.254: v17.14,41.27 18.41,40.01 v38.73,40.01 | X1.14 88.27,41.27 76.2,41.27 74.3,39.37 v70.48,39.37 | v66.04,27.94 41.91,27.94 HDR2.11 | U$1.B28 43.18,12.06 v42.54,12.06
A10  (via drill 0.3)
  Top 0.254: MEM.21 27.94,45.72 28.57,45.72 36.83,37.47 36.83,29.84 39.37,27.3 39.37,25.4 HDR2.12 40.64,19.68 | X1.15 87.63,45.72 87.63,40.01 85.09,37.47 v85.09,26.04 | 40.64,19.68 v41.91,18.41 | 40.64,19.68 U$1.A29
  Bottom 0.254: v85.09,26.04 85.09,23.5 83.82,22.23 78.11,22.23 75.56,19.68 63.5,19.68 62.87,19.05 49.53,19.05 48.89,18.41 v41.91,18.41
A11  (via drill 0.3)
  Top 0.254: v17.78,41.91 MEM.23 | v38.73,41.27 41.27,38.73 41.27,27.94 41.91,27.3 41.91,25.4 HDR2.10 43.18,20.32 | X1.16 90.17,45.72 90.17,47.62 87,50.8 62.87,50.8 59.69,47.62 59.69,41.27 60.96,40.01 61.91,40.01 62.55,40.64 63.18,40.64 63.5,40.32 63.5,32.38 62.23,31.11 62.23,23.18 v58.42,19.68 | 43.18,20.32 v44.45,19.05 | 43.18,20.32 U$1.A28
  Bottom 0.254: v17.78,41.91 18.41,41.27 v38.73,41.27 | v58.42,19.68 48.89,19.68 48.26,19.05 v44.45,19.05
A12  (via drill 0.3)
  Top 0.254: 48.26,22.23 v47.62,21.59 | 48.26,22.23 HDR2.6 46.99,25.4 46.99,32.38 v47.62,33.02 | v74.93,41.27 v74.93,50.16 | v54.61,41.27 53.97,40.64 v53.97,35.56 | 48.26,22.23 U$1.A26
  Bottom 0.254: MEM.2 7.62,33.34 13.02,27.94 23.5,27.94 24.13,27.3 24.13,23.5 26.04,21.59 v47.62,21.59 | X1.17 86.36,47.62 84.45,49.53 77.15,49.53 76.52,50.16 v74.93,50.16 | v54.61,41.27 v74.93,41.27 | v53.97,35.56 51.43,33.02 v47.62,33.02
A13  (via drill 0.3)
  Top 0.254: HDR2.15 36.83,25.4 v36.83,17.14 v36.83,12.06 | v88.27,42.55 88.27,29.21 90.17,27.3 v90.17,17.14
  Bottom 0.254: U$1.B30 38.1,10.79 v36.83,12.06 | v88.27,42.55 X1.18 | v36.83,17.14 v90.17,17.14
A14  (via drill 0.3)
  Top 0.254: 49.53,25.4 HDR2.5 | v49.53,12.06 49.53,25.4 | v48.89,40.01 49.53,39.37 49.53,25.4
  Bottom 0.254: U$1.B25 50.8,10.79 v49.53,12.06 | X1.19 83.82,46.35 82.55,45.09 82.55,43.81 81.92,43.18 52.07,43.18 v48.89,40.01
A15  (via drill 0.3)
  Top 0.254: U$1.A24 HDR2.2 | v57.78,42.55 56.51,41.27 56.51,36.83 55.88,36.2 55.88,28.57 57.15,27.3 v57.15,26.04
  Bottom 0.254: v57.78,42.55 82.55,42.55 83.82,43.81 X1.20 | v57.15,26.04 55.24,24.13 HDR2.2
BD0  (via drill 0.3)
  Top 0.254: v52.7,48.9 v52.7,39.37 | X1.21 80.01,45.72 80.01,43.81 81.28,42.55 HDR1.25 81.28,26.04 80.01,24.77 80.01,15.88 v79.38,15.24 | v71.12,11.43 72.39,12.7 v72.39,14.61
  Bottom 0.254: MEM.11 30.48,36.51 33.02,39.05 40.32,39.05 40.64,38.73 52.07,38.73 v52.7,39.37 | v52.7,48.9 80.01,48.9 81.28,47.62 X1.21 | v71.12,11.43 U$1.B17 | v72.39,14.61 73.03,15.24 v79.38,15.24
BD1  (via drill 0.3)
  Top 0.254: HDR1.27 v78.74,31.43 v78.74,35.56 | X1.22 81.92,43.81 81.92,38.1 83.82,36.2 v83.82,27.94 | v68.58,11.43 69.85,12.7 69.85,29.21 v71.76,31.11
  Bottom 0.254: MEM.12 35.24,37.15 41.91,37.15 42.23,37.47 76.84,37.47 v78.74,35.56 | v83.82,27.94 80.01,27.94 HDR1.27 | v68.58,11.43 U$1.B18 | v78.74,31.43 78.42,31.11 v71.76,31.11
BD2  (via drill 0.3)
  Top 0.254: MEM.13 35.88,34.29 v35.88,29.84 | HDR1.30 75.56,24.77 | 75.56,24.77 74.93,25.4 74.93,28.57 v74.3,29.21 74.3,38.73 77.47,41.91 77.47,45.09 v76.84,45.72 | v74.93,12.06 75.56,12.7 75.56,24.77
  Bottom 0.254: v35.88,29.84 36.51,29.21 v74.3,29.21 | X1.23 77.47,45.72 v76.84,45.72 | v74.93,12.06 67.31,12.06 66.04,10.79 U$1.B19
BD3  (via drill 0.3)
  Top 0.254: v77.47,50.16 77.47,45.72 78.11,45.09 | X1.24 78.11,45.09 | HDR1.29 78.11,28.57 78.11,45.09 | v63.5,12.06 66.67,15.24 v66.67,22.86
  Bottom 0.254: MEM.15 38.73,50.8 76.84,50.8 v77.47,50.16 | v63.5,12.06 U$1.B20 | v66.67,22.86 67.31,23.5 67.31,24.77 67.95,25.4 74.93,25.4 HDR1.29
BD4  (via drill 0.3)
  Top 0.254: HDR1.32 73.03,23.5 v73.03,13.34 | MEM.16 37.46,48.26 39.37,48.26 v40.64,49.53 | X1.25 76.2,48.9 v75.56,49.53 | v55.24,13.34 54.61,13.97 54.61,33.66 52.07,36.2 v52.07,49.53
  Bottom 0.254: v73.03,13.34 72.39,12.7 62.23,12.7 60.96,11.43 | U$1.B21 60.96,11.43 | v40.64,49.53 41.27,50.16 50.16,50.16 50.8,49.53 v52.07,49.53 v75.56,49.53 | 60.96,11.43 59.05,13.34 v55.24,13.34
BD5  (via drill 0.3)
  Top 0.254: v37.46,45.72 MEM.17 | HDR1.31 73.66,38.73 76.2,41.27 X1.26 | v58.42,11.43 56.51,13.34 56.51,27.3 55.24,28.57 v55.24,45.72
  Bottom 0.254: v37.46,45.72 v55.24,45.72 74.93,45.72 X1.26 | v58.42,11.43 U$1.B22
BD6  (via drill 0.3)
  Top 0.254: MEM.18 34.29,46.35 34.29,45.09 37.46,41.91 39.37,41.91 41.91,39.37 41.91,34.29 43.18,33.02 45.72,33.02 46.99,34.29 46.99,43.18 49.53,45.72 51.43,45.72 | 51.43,45.72 51.43,28.57 HDR2.1 | v70.48,50.16 X1.27 | 51.43,45.72 v51.43,50.16 | v55.88,26.04 v55.88,11.43
  Bottom 0.254: v51.43,50.16 v70.48,50.16 | v55.88,11.43 U$1.B23 | v55.88,26.04 55.24,26.67 HDR2.1
BD7  (via drill 0.3)
  Top 0.254: v33.02,45.09 MEM.19 | v50.16,45.09 50.8,44.45 v50.8,36.83 HDR2.3 52.07,25.4 52.07,12.7 v52.7,12.06 | X1.28 73.03,43.81 v73.03,36.83
  Bottom 0.254: v50.16,45.09 v33.02,45.09 | v50.8,36.83 v73.03,36.83 | U$1.B24 53.34,12.06 v52.7,12.06
BORDER
  Top 0.254: HDR1.14 95.89,23.5 95.89,13.34 93.98,11.43 U$1.A8
DEB  (via drill 0.3)
  Top 0.254: HDR1.13 95.89,26.04 95.89,25.4 95.25,24.77 v95.25,14.61
  Bottom 0.254: v95.25,14.61 93.34,12.7 90.17,12.7 88.9,11.43 U$1.B10
EC0  (via drill 0.3)
  Top 0.254: v82.55,21.59 80.65,19.68 v80.65,12.06
  Bottom 0.254: HDR1.19 87.63,25.4 87.63,23.18 86.04,21.59 v82.55,21.59 | v80.65,12.06 81.28,11.43 U$1.B13
EC1  (via drill 0.3)
  Top 0.254: HDR1.22 85.73,23.5 v85.73,20.95 | v82.55,19.05 81.28,17.78 U$1.A13
  Bottom 0.254: v85.73,20.95 83.82,19.05 v82.55,19.05
EC2  (via drill 0.3)
  Top 0.254: v83.82,20.95 HDR1.24 | v79.38,19.68 78.74,19.05 U$1.A14
  Bottom 0.254: v83.82,20.95 82.55,19.68 v79.38,19.68
EC3
  Top 0.254: HDR1.20 88.27,23.5 88.27,21.27 85.73,18.73 85.73,13.34 83.82,11.43 U$1.A12
EX_A13  (via drill 0.3)
  Top 0.254: HDR1.37 65.41,27.3 v65.41,39.37 | v55.88,40.01 55.88,46.99 52.07,50.8 50.8,50.8 A13.3
  Bottom 0.254: v65.41,39.37 58.42,39.37 57.78,40.01 v55.88,40.01
EX_A14  (via drill 0.3)
  Top 0.254: HDR1.38 64.77,25.4 v64.77,33.02 | v50.16,36.2 50.16,40.01 A14.3
  Bottom 0.254: v64.77,33.02 56.51,33.02 54.61,34.92 54.61,35.88 54.29,36.2 v50.16,36.2
EX_A15  (via drill 0.3)
  Top 0.254: v63.5,31.11 HDR1.39 | v48.89,31.11 48.26,31.75 A15.3
  Bottom 0.254: v48.89,31.11 v63.5,31.11
GND  (via drill 0.3, 0.35)
  Top 0.508: v38.1,38.1 MEM.14 | X1.1 114.3,39.37 R1.2 111.76,33.02 HDR1.1 HDR1.2 113.03,22.86 113.03,13.34 111.76,12.06 U$1.B1 | v82.87,32.07 82.55,32.38 R2.2 | v34.29,38.1 v26.04,38.1 | v9.53,38.1 6.35,41.27 C1.2
  Bottom 0.508: R2.2 81.92,35.56 79.38,38.1 v38.1,38.1 v34.29,38.1 | U$1.B1 111.76,12.06 113.03,13.34 113.03,22.86 HDR1.2 | v82.87,32.07 83.19,31.75 106.68,31.75 HDR1.1 | v26.04,38.1 v9.53,38.1
  pour Bottom: -0.64,53.34 -0.64,10.79 117.16,10.79 117.48,11.11 117.48,46.04 110.17,53.34 0.95,53.34 0.64,53.66
IDA_N  (via drill 0.3)
  Top 0.254: HDR2.25 21.59,25.4 v21.59,12.06
  Bottom 0.254: U$1.B36 22.86,10.79 v21.59,12.06
IDB_N  (via drill 0.3)
  Top 0.254: HDR2.29 16.51,25.4 v16.51,12.06
  Bottom 0.254: U$1.B38 17.78,10.79 v16.51,12.06
LPEN  (via drill 0.3)
  Top 0.254: HDR1.11 98.42,26.04 98.42,25.4 97.79,24.77 v97.79,14.61
  Bottom 0.254: v97.79,14.61 95.25,12.06 92.08,12.06 91.44,11.43 U$1.B9
MUX  (via drill 0.3)
  Top 0.254: v89.54,18.41 88.9,17.78 U$1.A10
  Bottom 0.254: v89.54,18.41 93.98,22.86 HDR1.16
N$1
  Bottom 0.254: +5V.K 104.14,35.56 R1.1
N$2
  Bottom 0.254: R2.1 91.44,36.83 +12V.K
N$5
  Bottom 0.254: 57.78,34.92 59.05,34.92
N$6
  Bottom 0.254: 43.81,35.56 45.08,35.56
N$7
  Bottom 0.254: 43.81,41.91 45.08,41.91
N$8
  Bottom 0.254: 43.81,48.26 45.08,48.26
R_A13  (via drill 0.3)
  Top 0.254: MEM.26 13.34,46.99 v13.34,42.55 | v38.1,42.55 41.91,46.35 41.91,49.53 42.54,50.16 45.08,50.16 45.72,49.53 A13.2
  Bottom 0.254: v38.1,42.55 v13.34,42.55
R_A14  (via drill 0.3)
  Top 0.254: v12.7,44.45 7.62,49.53 MEM.27 | v33.65,43.81 40,37.47 v40,36.2 | v44.45,33.66 44.45,40.64 A14.2
  Bottom 0.254: v12.7,44.45 13.34,43.81 v33.65,43.81 | v40,36.2 42.54,33.66 v44.45,33.66
R_A15  (via drill 0.3)
  Top 0.254: v45.08,40.01 45.72,39.37 A15.2
  Bottom 0.254: MEM.1 5.08,35.88 12.38,43.18 39.37,43.18 42.54,40.01 v45.08,40.01
RESET
  Top 0.254: U$1.A35 HDR2.24
SOUND  (via drill 0.3)
  Top 0.254: v74.93,20.32 73.66,19.05 U$1.A16 | v80.65,38.1 80.01,37.47 80.01,25.4 HDR1.28
  Bottom 0.254: v74.93,20.32 HDR1.28 | X1.3 102.87,45.72 102.87,43.81 97.16,38.1 v80.65,38.1
TX/RX  (via drill 0.3)
  Top 0.254: v79.38,22.86 78.11,21.59 78.11,13.34 76.2,11.43 U$1.A15
  Bottom 0.254: HDR1.26 80.01,22.86 v79.38,22.86

### Text on the board
tPlace: +5V | EX_A13 | !BRD | !MREQ | BD0 | A0 | SND | GND | +5V | EX_A14 | BD7 | A15 | A1 | +5V | !BWR | !BIORQ | 3M125 | +5V | EX_A15 | !EXP_n | !EX_CE | !EXP | LPEN | !BRD | !BWR | !BRESET | !BM1 | !EXP_n | IDB | !INT_n | IDA | !ClrINT_n | !P2 | !VIDLSB | A13 | A4 | A9 | A7 | A8 | A14 | BD7 | BD6 | EX_A15 | EX_A13 | BD5 | BD3 | BD1 | BD0 | !PHNTM | !EXTC | EC0 | A1 | 6M25 | DEB | 3M125 | -12V | +12V | +5V | GND | !BRFSH | !BMREQ | !B0 | !BIORQ | !SLOT_n | !INT | !WAIT | RESET | !BUSRQ | !P3 | A0 | A2 | A10 | A11 | A6 | A12 | A5 | A15 | !EX_CE | EX_A14 | BD4 | BD2 | SOUND | TX/RX | EC2 | EC1 | EC3 | A3 | MUX | BORDER | !VSYNC | !HSYNC | !NMI | Videoton TVC Expansion / breakout board | rev2
bPlace: A6 | !INTn | !PHNTM | !BRES | !BRD | !SLOTn | !BMRQ | BD6 | BD4 | BD2 | BD0 | A14 | A12 | A10 | A8 | A4 | A2 | A0 | SND | GND | 1 | 40 | !ClrINTn | !INT | !NMI | !BWR | !EXPn | !BIORQ | BD7 | BD5 | BD3 | BD1 | A15 | A13 | A11 | A9 | A7 | A5 | A3 | A1 | 3.125MHz | +5V | Billentyűzet oldal | VS / 2021